# Altium project zytek_ctl.PrjPcb
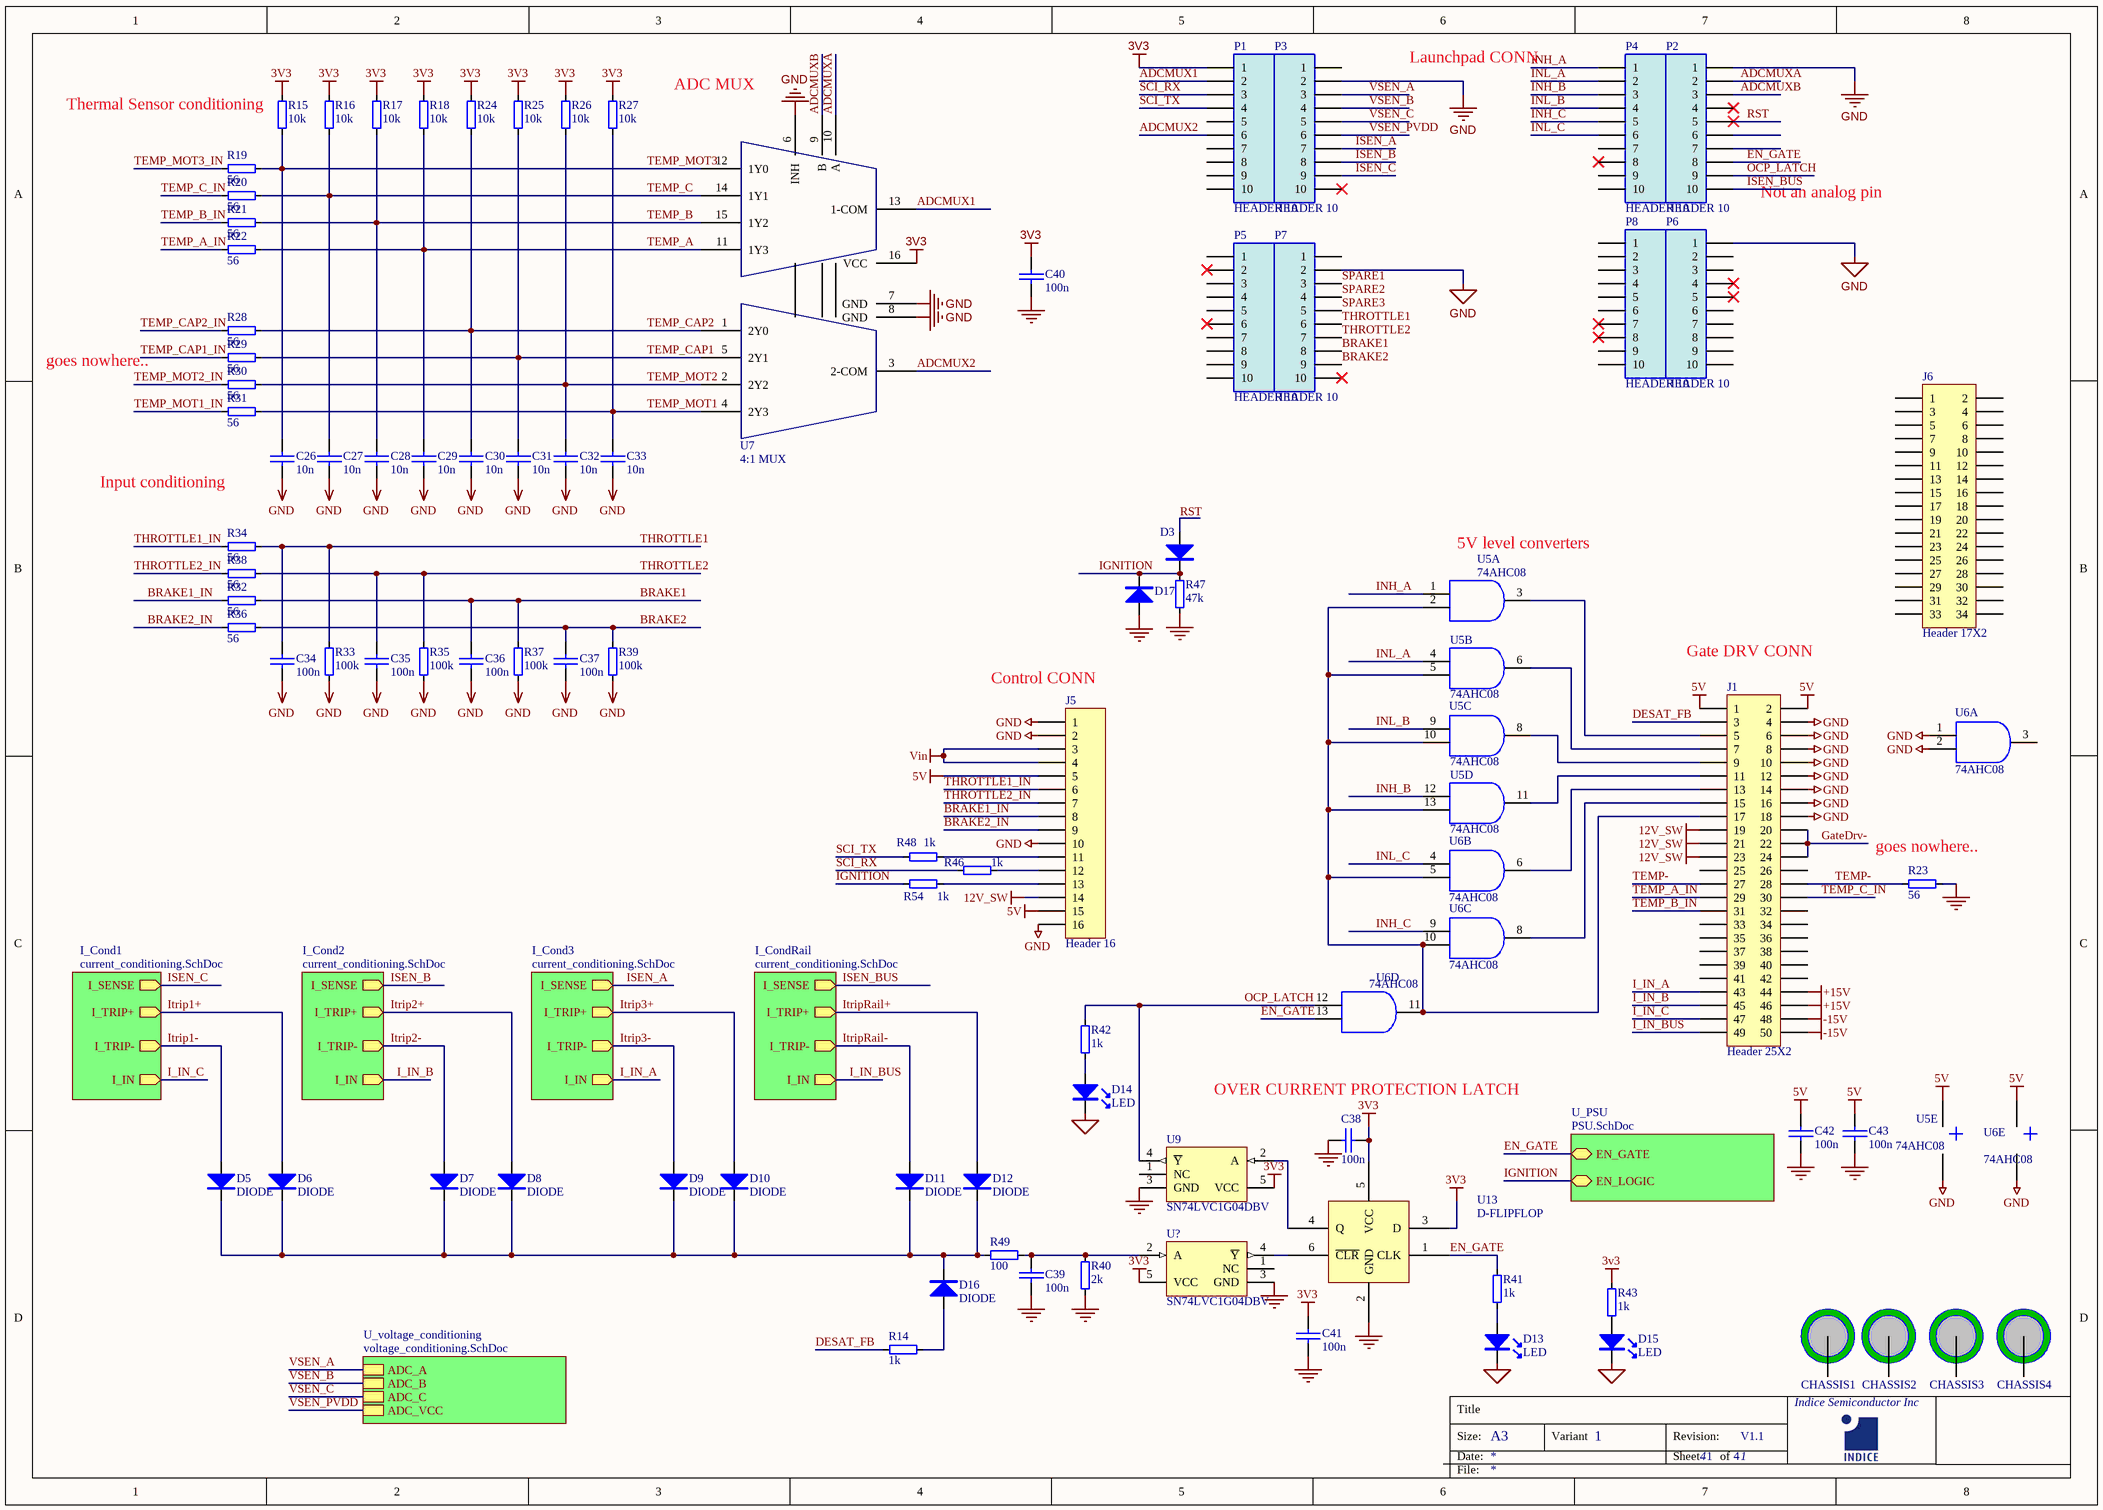
[diagram p0: zytek_ctl.SchDoc]
pcb_rev: V1.0; prjAuthor: Jarrod Tuma; PROJECT_NAME: 3-ph PLC control; sch_rev: V1.1
4 sheets, 278 parts. Net scope: hierarchical (ports join the sheet entries above them; power ports are global).
Board file: zytek_ctl.PcbDoc
Sheets:
  zytek_ctl.SchDoc
    U_PSU = PSU.SchDoc
    I_Cond1 = current_conditioning.SchDoc
    I_Cond2 = current_conditioning.SchDoc
    I_Cond3 = current_conditioning.SchDoc
    I_CondRail = current_conditioning.SchDoc
    U_voltage_conditioning = voltage_conditioning.SchDoc

## Sheet zytek_ctl.SchDoc
size A3; DocumentNumber: 1; SheetNumber: 1; SheetTotal: 4

### Parts
C26  10n  [0603]
C27  10n  [0603]
C28  10n  [0603]
C29  10n  [0603]
C30  10n  [0603]
C31  10n  [0603]
C32  10n  [0603]
C33  10n  [0603]
C34  100n  [0603]
C35  100n  [0603]
C36  100n  [0603]
C37  100n  [0603]
C38  100n  [0603]
C39  100n  [0603]
C40  100n  [0603]
C41  100n  [0603]
C42  100n  [0603]
C43  100n  [0603]
CHASSIS1  M2.0  [M4.0]  (value not drawn)  (no BOM)
CHASSIS2  M2.0  [M4.0]  (value not drawn)  (no BOM)
CHASSIS3  M2.0  [M4.0]  (value not drawn)  (no BOM)
CHASSIS4  M2.0  [M4.0]  (value not drawn)  (no BOM)
D3  (no value)  [SOD323-AK]
D5  DIODE  [D-0603]
D6  DIODE  [D-0603]
D7  DIODE  [D-0603]
D8  DIODE  [D-0603]
D9  DIODE  [D-0603]
D10  DIODE  [D-0603]
D11  DIODE  [D-0603]
D12  DIODE  [D-0603]
D13  LED  [0603_LED]
D14  LED  [0603_LED]
D15  LED  [0603_LED]
D16  DIODE  [D-0603]
D17  (no value)  [SOD323-AK]
J1  Header 25X2  [HDR2X20_2mm]
J5  Header 16  [HDR1X16]
J6  Header 17X2  [HDR2X17_2mm]
P1  HEADER 10  [HDR10]
P2  HEADER 10  [HDR10]
P3  HEADER 10  [HDR10]
P4  HEADER 10  [HDR10]
P5  HEADER 10  [HDR10]
P6  HEADER 10  [HDR10]
P7  HEADER 10  [HDR10]
P8  HEADER 10  [HDR10]
R14  1k  [0603]
R15  10k  [0603]
R16  10k  [0603]
R17  10k  [0603]
R18  10k  [0603]
R19  56  [0603]
R20  56  [0603]
R21  56  [0603]
R22  56  [0603]
R23  56  [0603]
R24  10k  [0603]
R25  10k  [0603]
R26  10k  [0603]
R27  10k  [0603]
R28  56  [0603]
R29  56  [0603]
R30  56  [0603]
R31  56  [0603]
R32  56  [0603]
R33  100k  [0603]
R34  56  [0603]
R35  100k  [0603]
R36  56  [0603]
R37  100k  [0603]
R38  56  [0603]
R39  100k  [0603]
R40  2k  [0603]
R41  1k  [0603]
R42  1k  [0603]
R43  1k  [0603]
R46  1k  [0603]
R47  47k  [0805]
R48  1k  [0603]
R49  100  [0603]
R54  1k  [0603]
U5  74AHC08  [SOIC14]  (parts A,B,C,D,E of 5)
U6  74AHC08  (parts A,B,C,D,E of 5)
U7  4:1 MUX  [SOIC16]
U9  SN74LVC1G04DBV  [SOT23-5]
U13  D-FLIPFLOP  [SOT23-6]
U?  SN74LVC1G04DBV  [SOT23-5]

### Sub-sheets
I_Cond1 = current_conditioning.SchDoc: I_SENSE (out), I_TRIP+ (out), I_TRIP- (out), I_IN (out)
I_Cond2 = current_conditioning.SchDoc: I_SENSE (out), I_TRIP+ (out), I_TRIP- (out), I_IN (out)
I_Cond3 = current_conditioning.SchDoc: I_SENSE (out), I_TRIP+ (out), I_TRIP- (out), I_IN (out)
I_CondRail = current_conditioning.SchDoc: I_SENSE (out), I_TRIP+ (out), I_TRIP- (out), I_IN (out)
U_PSU = PSU.SchDoc: EN_GATE, EN_LOGIC
U_voltage_conditioning = voltage_conditioning.SchDoc: ADC_A, ADC_B, ADC_C, ADC_VCC

### Nets
3v3: C38.1 C40.1 C41.1 P1.1 R15.2 R16.2 R17.2 R18.2 R24.2 R25.2 R26.2 R27.2 R43.2 U7.16(VCC) U9.5(VCC) U13.3(D) U13.5(VCC) U?.5(VCC)
5V: C42.1 C43.1 J1.1 J1.2 J5.5 J5.15 U5.14(Vcc) U6.14(Vcc)
12V_SW: J1.19 J1.21 J1.23 J5.14
+15V: J1.44 J1.46
-15V: J1.48 J1.50
GND: C26.2 C27.2 C28.2 C29.2 C30.2 C31.2 C32.2 C33.2 C34.2 C35.2 C36.2 C37.2 C38.2 C39.2 C40.2 C41.2 C42.2 C43.2 D13.2(K) D14.2(K) D15.2(K) D17.A J1.4 J1.6 J1.8 J1.10 J1.12 J1.14 J1.16 J1.18 J5.1 J5.2 J5.10 J5.16 P2.1 P3.2 P6.1 P7.2 R23.2 R33.1 R35.1 R37.1 R39.1 R40.2 R47.2 U5.7(GND) U6.1(1A) U6.2(1B) U6.7(GND) U7.6(INH) U7.7(GND) U7.8(GND) U9.3(GND) U13.2(GND) U?.3(GND)
Vin: J5.3 J5.4
ADCMUX1: P1.2 U7.13(1-COM)
ADCMUX2: P1.6 U7.3(2-COM)
ADCMUXA: P2.2 U7.10(A)
ADCMUXB: P2.3 U7.9(B)
BRAKE1: C36.1 P7.8 R32.2 R37.2
BRAKE1_IN: J5.8 R32.1
BRAKE2: C37.1 P7.9 R36.2 R39.2
BRAKE2_IN: J5.9 R36.1
DESAT_FB: J1.3 R14.2
EN_GATE: P2.8 R41.2 U6.13(4B) U13.1(CLK) ; sheet U_PSU/EN_GATE
GateDrv-: J1.20 J1.22 J1.24
I_IN_A: J1.43 ; sheet I_Cond3/I_IN
I_IN_B: J1.45 ; sheet I_Cond2/I_IN
I_IN_BUS: J1.49 ; sheet I_CondRail/I_IN
I_IN_C: J1.47 ; sheet I_Cond1/I_IN
IGNITION: D3.K D17.K R47.1 R54.1 ; sheet U_PSU/EN_LOGIC
INH_A: P4.1 U5.1(1A)
INH_B: P4.3 U5.12(4A)
INH_C: P4.5 U6.9(3A)
INL_A: P4.2 U5.4(2A)
INL_B: P4.4 U5.9(3A)
INL_C: P4.6 U6.4(2A)
ISEN_A: P3.7 ; sheet I_Cond3/I_SENSE
ISEN_B: P3.8 ; sheet I_Cond2/I_SENSE
ISEN_BUS: P2.10 ; sheet I_CondRail/I_SENSE
ISEN_C: P3.9 ; sheet I_Cond1/I_SENSE
Itrip1+: D6.A ; sheet I_Cond1/I_TRIP+
Itrip1-: D5.A ; sheet I_Cond1/I_TRIP-
Itrip2+: D8.A ; sheet I_Cond2/I_TRIP+
Itrip2-: D7.A ; sheet I_Cond2/I_TRIP-
Itrip3+: D10.A ; sheet I_Cond3/I_TRIP+
Itrip3-: D9.A ; sheet I_Cond3/I_TRIP-
ItripRail+: D12.A ; sheet I_CondRail/I_TRIP+
ItripRail-: D11.A ; sheet I_CondRail/I_TRIP-
OCP_LATCH: P2.9 R42.2 U6.12(4A) U9.4(~{Y})
RST: D3.A P2.5
SCI_RX: P1.3 R46.1
SCI_TX: P1.4 R48.1
SPARE1: P7.3
SPARE2: P7.4
SPARE3: P7.5
TEMP-: J1.27 J1.28 R23.1
TEMP_A: C29.1 R18.1 R22.2 U7.11(1Y3)
TEMP_A_IN: J1.29 R22.1
TEMP_B: C28.1 R17.1 R21.2 U7.15(1Y2)
TEMP_B_IN: J1.31 R21.1
TEMP_C: C27.1 R16.1 R20.2 U7.14(1Y1)
TEMP_C_IN: J1.30 R20.1
TEMP_CAP1: C31.1 R25.1 R29.2 U7.5(2Y1)
TEMP_CAP1_IN: R29.1
TEMP_CAP2: C30.1 R24.1 R28.2 U7.1(2Y0)
TEMP_CAP2_IN: R28.1
TEMP_MOT1: C33.1 R27.1 R31.2 U7.4(2Y3)
TEMP_MOT1_IN: R31.1
TEMP_MOT2: C32.1 R26.1 R30.2 U7.2(2Y2)
TEMP_MOT2_IN: R30.1
TEMP_MOT3: C26.1 R15.1 R19.2 U7.12(1Y0)
TEMP_MOT3_IN: R19.1
THROTTLE1: C34.1 P7.6 R33.2 R34.2
THROTTLE1_IN: J5.6 R34.1
THROTTLE2: C35.1 P7.7 R35.2 R38.2
THROTTLE2_IN: J5.7 R38.1
VSEN_A: P3.3 ; sheet U_voltage_conditioning/ADC_A
VSEN_B: P3.4 ; sheet U_voltage_conditioning/ADC_B
VSEN_C: P3.5 ; sheet U_voltage_conditioning/ADC_C
VSEN_PVDD: P3.6 ; sheet U_voltage_conditioning/ADC_VCC
NetC39_1: C39.1 R40.1 R49.2 U?.2(A)
NetD5_K: D5.K D6.K D7.K D8.K D9.K D10.K D11.K D12.K D16.K R49.1
NetD13_1: D13.1(A) R41.1
NetD14_1: D14.1(A) R42.1
NetD15_1: D15.1(A) R43.1
NetD16_A: D16.A R14.1
NetJ1_5: J1.5 U5.3(1Y)
NetJ1_7: J1.7 U5.6(2Y)
NetJ1_9: J1.9 U5.8(3Y)
NetJ1_11: J1.11 U5.11(4Y)
NetJ1_13: J1.13 U6.6(2Y)
NetJ1_15: J1.15 U6.8(3Y)
NetJ1_17: J1.17 U5.2(1B) U5.5(2B) U5.10(3B) U5.13(4B) U6.5(2B) U6.10(3B) U6.11(4Y)
NetJ5_11: J5.11 R48.2
NetJ5_12: J5.12 R46.2
NetJ5_13: J5.13 R54.2
NetU9_2: U9.2(A) U13.4(Q)
NetU13_6: U13.6(~{CLR}) U?.4(~{Y})

Not connected (* = marked no-connect by the designer): CHASSIS1 1; CHASSIS2 1; CHASSIS3 1; CHASSIS4 1; J1 25 26 32 33 34 35 36 37 38 39 40 41 42; J6 1 2 3 4 5 6 7 8 9 10 11 12 13 14 15 16 17 18 19 20 21 22 23 24 25 26 27 28 29 30 31 32 33 34; P1 5 7 8 9 10; P2 4* 6 7; P3 1 10*; P4 7 8* 9 10; P5 1 2* 3 4 5 6* 7 8 9 10; P6 2 3 4* 5* 6 7 8 9 10; P7 1 10*; P8 1 2 3 4 5 6 7* 8* 9 10; U6 3(1Y); U9 1(NC); U? 1(NC)

### Notes on the sheet
- (near R15) Thermal Sensor conditioning
- ADC MUX
- Launchpad CONN
- Not an analog pin
- goes nowhere..
- (near C26) Input conditioning
- (near U5) 5V level converters
- (near J5) Control CONN
- (near J1) Gate DRV CONN
- (near R23) goes nowhere..
- OVER CURRENT PROTECTION LATCH
- Title
- Size:
- Date:
- A3
- Variant
- Revision:
- Sheet
- of
- Indice Semiconductor Inc
- File:

### Library data of the parts
C26-C43 = CAP: Capacitor; Status: Draft
CHASSIS1-CHASSIS4 = M2.0_HOLE: 2.0mm Hole
D3 D17 = DIODE: Parameter: Signal, >=200mA, SOD323, Vr>=75V; Status: Draft
D13-D15 = LED: pin to pad: 1>A 2>K
J1 = Header 25X2: Header, 25-Pin, Dual row; LatestRevisionDate: 17-Jul-2002; LatestRevisionNote: Re-released for DXP Platform.; Publisher: Altium Limited
J5 = Header 16: Header, 16-Pin; LatestRevisionDate: 17-Jul-2002; LatestRevisionNote: Re-released for DXP Platform.; Publisher: Altium Limited
J6 = Header 17X2: Header, 17-Pin, Dual row; LatestRevisionDate: 17-Jul-2002; LatestRevisionNote: Re-released for DXP Platform.; Publisher: Altium Limited
P1-P8 = HEADER 10: 12 Pin Header; Status: Draft
R14 R19-R22 R28-R40 R49 = RES4: Parameter: 1%, Thick or Metal Film, 63mW
R15-R18 R24-R27 = RES4: Resistor; Parameter: *; Status: Draft
R23 R41-R43 R46 R48 R54 = RESISTOR: Parameter: *; Status: Draft
R47 = RESISTOR: Parameter: <1%, Thick film, 63mW; Status: Draft
U5 U6 = 74AHC08_QUAD_AND: Quad AND Gate
U7 = SN74LV4052A
U9 U? = CMP-0441-00001-1: Single Inverter Gate SOT-553; Manufacturer: Texas Instruments; Supply Voltage: 1.65 to 5.5 V; ComponentLink3URL: http://www.ti.com/litv/pdf/mpds018i; DatasheetVersion: SCES214Z, 11/2012; ComponentLink2URL: http://www.ti.com/lit/ds/symlink/sn74lvc1g04.pdf; Mounting Technology: Surface Mount; PackageDescription: 5-Pin Plastic Small Outline, Body 1.6 Ã— 2.9 mm, Pitch 0.95 mm; PackageVersion: 4073253-4/K, 03/2006; PackageReference: DBV5; Storage Temperature: -65 to 150 degC; ComponentLink3Description: Package Specification; ComponentLink2Description: Datasheet; Ambient Temperature: -40 to 85 degC; PartNumber: SN74LVC1G04DBV; ComponentLink1Description: Manufacturer URL; ComponentLink1URL: http://www.ti.com/
U13 = D-FLIPFLOP: With reset; Manufacturer 1: TI SN74LVC1G175; Digikey: 296-17617-1-ND
D5-D12 D16 = DIODE: Status: Draft

## Sheet PSU.SchDoc
size A; DocumentNumber: 3; SheetNumber: 3; SheetTotal: 4; PageSetup: Record=PageOptions|CenterHorizontal=True|CenterVertical=True|PrintScale=1.00|XCorrection=1.00|YCorrection=1.00|PrintKind=1|BorderSize=5000000|LeftOffset=0|BottomOffset=0|Orientation=2|PaperLength=1000|PaperWidth=1000|Scale=100|PaperSource=7|PrintQuality=-3|MediaType=1|DitherType=10|PrintScaleMode=1|PaperKind=A4|PaperIndex=9
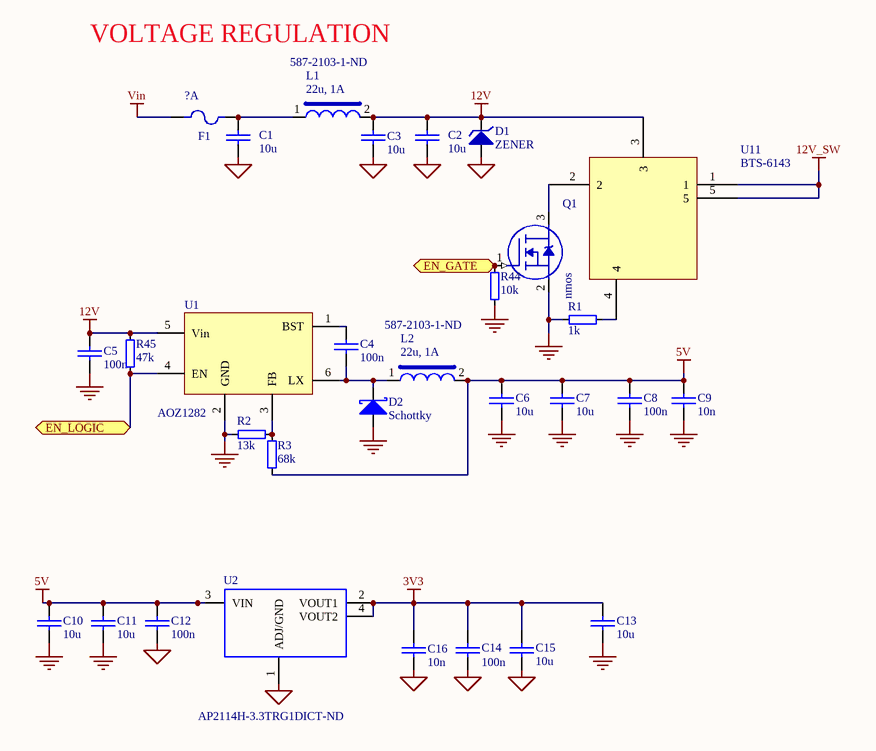
[diagram p1: PSU.SchDoc]

### Parts
C1  10u  [0805]
C2  10u  [0805]
C3  10u  [0805]
C4  100n  [0603]
C5  100n  [0603]
C6  10u  [0805]
C7  10u  [0805]
C8  100n  [0603]
C9  10n  [0603]
C10  10u  [0805]
C11  10u  [0805]
C12  100n  [0603]
C13  10u  [0805]
C14  100n  [0603]
C15  10u  [0805]
C16  10n  [0603]
D1  ZENER  [DO214AC]
D2  Schottky  [DO214AC]
F1  ?A  [1206]
L1  22u, 1A  Supplier Part Number 1: 587-2103-1-ND  [2220]
L2  22u, 1A  Supplier Part Number 1: 587-2103-1-ND  [2220]
Q1  nmos  [SOT23]
R1  1k  [0603]
R2  13k  [0603]
R3  68k  [0603]
R44  10k  [0603]
R45  47k  [0805]
U1  AOZ1282  [SOT23-6]
U2  AP2114H-3.3TRG1DICT-ND  [SOT223]
U11  BTS-6143  [TO252-5-11]

### Ports
EN_GATE, EN_LOGIC

### Nets
3v3: C13.2 C14.1 C15.1 C16.1 U2.2(VOUT1) U2.4(VOUT2)
5V: C6.2 C7.2 C8.1 C9.1 C10.2 C11.2 C12.1 L2.2 R3.1 U2.3(VIN)
12V: C2.1 C3.1 C5.1 D1.K L1.2 R45.1 U1.5(Vin) U11.3
12V_SW: U11.1 U11.5
GND: C1.2 C2.2 C3.2 C5.2 C6.1 C7.1 C8.2 C9.2 C10.1 C11.1 C12.2 C13.1 C14.2 C15.2 C16.2 D1.A D2.A Q1.2(S) R1.1 R2.1 R44.2 U1.2(GND) U2.1(ADJ/GND)
Vin: F1.1
EN_GATE: Q1.1(G) R44.1 ; port EN_GATE
IGNITION: R45.2 U1.4(EN) ; port EN_LOGIC
NetC1_1: C1.1 F1.2 L1.1
NetC4_1: C4.1 D2.K L2.1 U1.6(LX)
NetC4_2: C4.2 U1.1(BST)
NetQ1_3: Q1.3(D) U11.2
NetR1_2: R1.2 U11.4
NetR2_2: R2.2 R3.2 U1.3(FB)

### Notes on the sheet
- VOLTAGE REGULATION

### Library data of the parts
C1-C3 C12 C15 = CAP: Capacitor; Status: Draft
C4 C5 C8 C9 = CAP: Manufacturer 1: Murata GRM188R71H104KA93D; Parameter: 100n, 0603, 50V, <20%, X7R Ceramic; Digikey Part Number: PCC2153CT-ND; Manufacturer 2: TDK C1608X7R1H104K; Manufacturer 3: AVX 06035C104KAT2A; Manufacturer 5: Yageo CC0603KRX7R9BB104; Manufacturer 4: Kemet C0603C104J5RACTU-ND
C6 C7 C10 C11 C13 = CAP: Capacitor; Parameter: 10uF, 0805, =>6.3V, <=10%, X5R Ceramic
C14 = CAP: Manufacturer 1: Murata GCM188R71C474KA55D; Parameter: 470n, 0603, >=16V, <20%, X7R Ceramic; Digikey Part Number: 490-4775-1-ND; Manufacturer 2: Taiyo EMK107B7474KA-T; Manufacturer 3: Kemet C0603C474K4RACTU, C0603C474K4RAC; Manufacturer 4: TDK C1608X7R1C474M
C16 = CAP: Manufacturer 1: Murata GRM188R71H103KA01D; Parameter: 10n, 0603, 50V, <20%, X7R Ceramic; Digikey Part Number: PCC2153CT-ND; Manufacturer 2: AVX	06035C103KAT2A; Manufacturer 3: TDK  C1608X7R1H103J
D1 = ZENER: Zener Diode; Manufacturer 1: *; Manufacturer 2: *; Manufacturer 3: *; Parameter: *; Status: Draft
D2 = DIODE SCHOTTKY: Schottky Diode; Manufacturer 1: Micro Commercial Co SD103AWS-TP; Parameter: DIODE SHOTTKY >30V >0.2A; Digikey Part Number: SD103AWSTPMSCT-ND; Status: Draft
F1 = FUSE: Thermal Fuse
L1 L2 = INDUCTOR-1 COIL: Standard single coil inductor; Parameter: INDUCTOR 22uH >1A 1210; Manufacturer 2: *; Manufacturer 3: *; Status: Draft; Supplier 1: Digi-Key
Q1 = MOSFET-N: N-Channel MOSFET; Manufacturer 1: *; Manufacturer 2: *; Manufacturer 3: *; Parameter: *; Status: Draft
R1-R3 R45 = RESISTOR: Parameter: <1%, Thick film, 63mW; Status: Draft
R44 = RES4: Parameter: 1%, Thick or Metal Film, 63mW
U1 = AOZ1280: Manufacturer 1: Alpha & Omega AOZ1282CI; Parameter: 1.2A, 4.5V-36V input, 450KHz; Digikey Part Number: 785-1613-1-ND
U2 = TLV1117-33

## Sheet current_conditioning.SchDoc
size A4; DocumentNumber: 2; SheetNumber: 2; SheetTotal: 4
Used 4 times, as channels I_Cond1, I_Cond2, I_Cond3, I_CondRail. Parts and nets are listed once, with the designators drawn on the sheet.
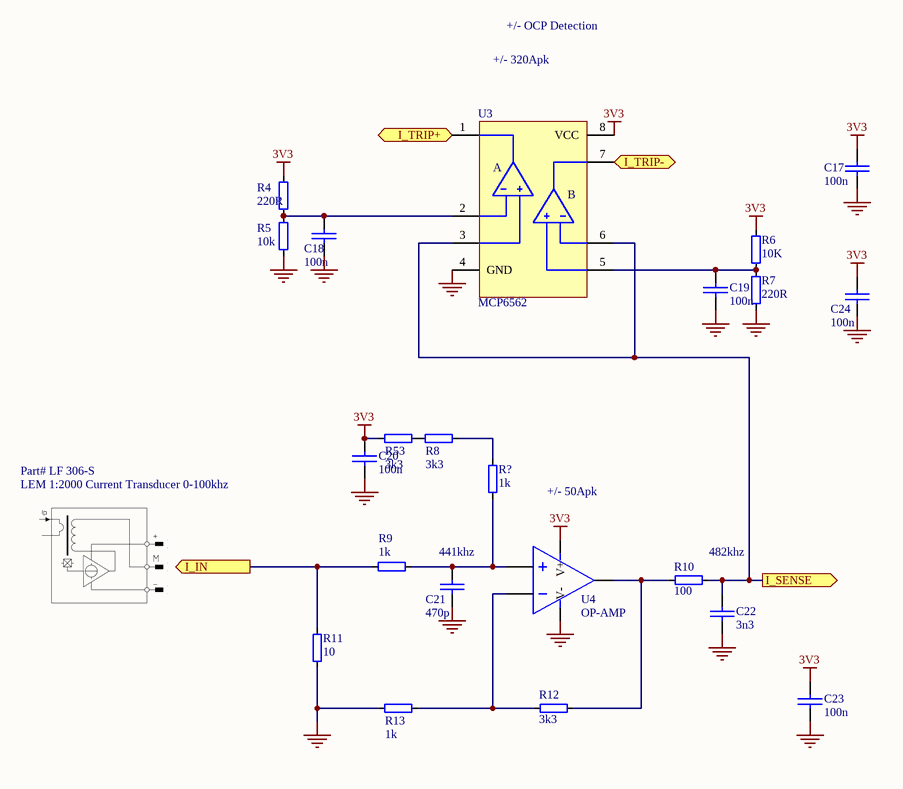
[diagram p2: current_conditioning.SchDoc]

### Parts
C17  100n  [0603]
C18  100n  [0603]
C19  100n  [0603]
C20  100n  [0603]
C21  470p  [0603]
C22  3n3  [0603]
C23  100n  [0603]
C24  100n  [0603]
R4  220R  [0603]
R5  10k  [0603]
R6  10K  [0603]
R7  220R  [0603]
R8  3k3  [0603]
R9  1k  [0603]
R10  100  [0603]
R11  10  [1206]
R12  3k3  [0603]
R13  1k  [0603]
R53  3k3  [0603]
R?  1k  [0603]
U3  MCP6562  [MSOP8]
U4  OP-AMP  [SOT23-5]

### Ports
I_IN (out), I_SENSE (out), I_TRIP+ (out), I_TRIP- (out)

### Nets
3V3: C17.1 C20.2 C23.1 C24.1 R4.2 R6.2 R53.1 U3.8(VCC) U4.5(V+)
GND: C17.2 C18.2 C19.2 C20.1 C21.2 C22.1 C23.2 C24.2 R5.1 R7.1 R11.1 R13.1 U3.4(GND) U4.2(V-)
I_IN: R9.1 R11.2 ; port I_IN
I_SENSE: C22.2 R10.2 U3.3(+A) U3.6(-B) ; port I_SENSE
I_TRIP+: U3.1(OUTA) ; port I_TRIP+
I_TRIP-: U3.7(OUTB) ; port I_TRIP-
NetC18_1: C18.1 R4.1 R5.2 U3.2(-A)
NetC19_1: C19.1 R6.1 R7.2 U3.5(+B)
NetC21_1: C21.1 R9.2 R?.1 U4.3(IN+)
NetR8_1: R8.1 R53.2
NetR8_2: R8.2 R?.2
NetR10_1: R10.1 R12.2 U4.1(OUT)
NetR12_1: R12.1 R13.2 U4.4(IN-)

### Channels
I_Cond1: designators end in _I_Cond1; ports I_IN=I_IN_C I_SENSE=ISEN_C I_TRIP+=Itrip1+ I_TRIP-=Itrip1-
I_Cond2: designators end in _I_Cond2; ports I_IN=I_IN_B I_SENSE=ISEN_B I_TRIP+=Itrip2+ I_TRIP-=Itrip2-
I_Cond3: designators end in _I_Cond3; ports I_IN=I_IN_A I_SENSE=ISEN_A I_TRIP+=Itrip3+ I_TRIP-=Itrip3-
I_CondRail: designators end in _I_CondRail; ports I_IN=I_IN_BUS I_SENSE=ISEN_BUS I_TRIP+=ItripRail+ I_TRIP-=ItripRail-

### Notes on the sheet
- +/- OCP Detection
- +/- 320Apk
- LEM 1:2000 Current Transducer 0-100khz
- Part# LF 306-S
- +/- 50Apk
- 441khz
- (near R10) 482khz
- (in symbol COMPARATOR DUAL draft) A; B

### Library data of the parts
C17 C20 C22 C23 = CAP
C18 C19 C21 C24 = CAP: Capacitor; Status: Draft
R4-R13 R53 R? = RES4: Parameter: 1%, Thick or Metal Film, 63mW
U3 = COMPARATOR DUAL draft: Manufacturer 1: Microchip MCP6562
U4 = OP-AMP: Operational Amplifier; Manufacturer 1: Microchip MCP6283T; Parameter: >1MHz, 3.3V, rail-rail.; Digikey Part Number: MCP6283T-E/CHCT-ND; Manufacturer 2: Fairchild FAN4174IS5X; Status: Draft

## Sheet voltage_conditioning.SchDoc
size A4
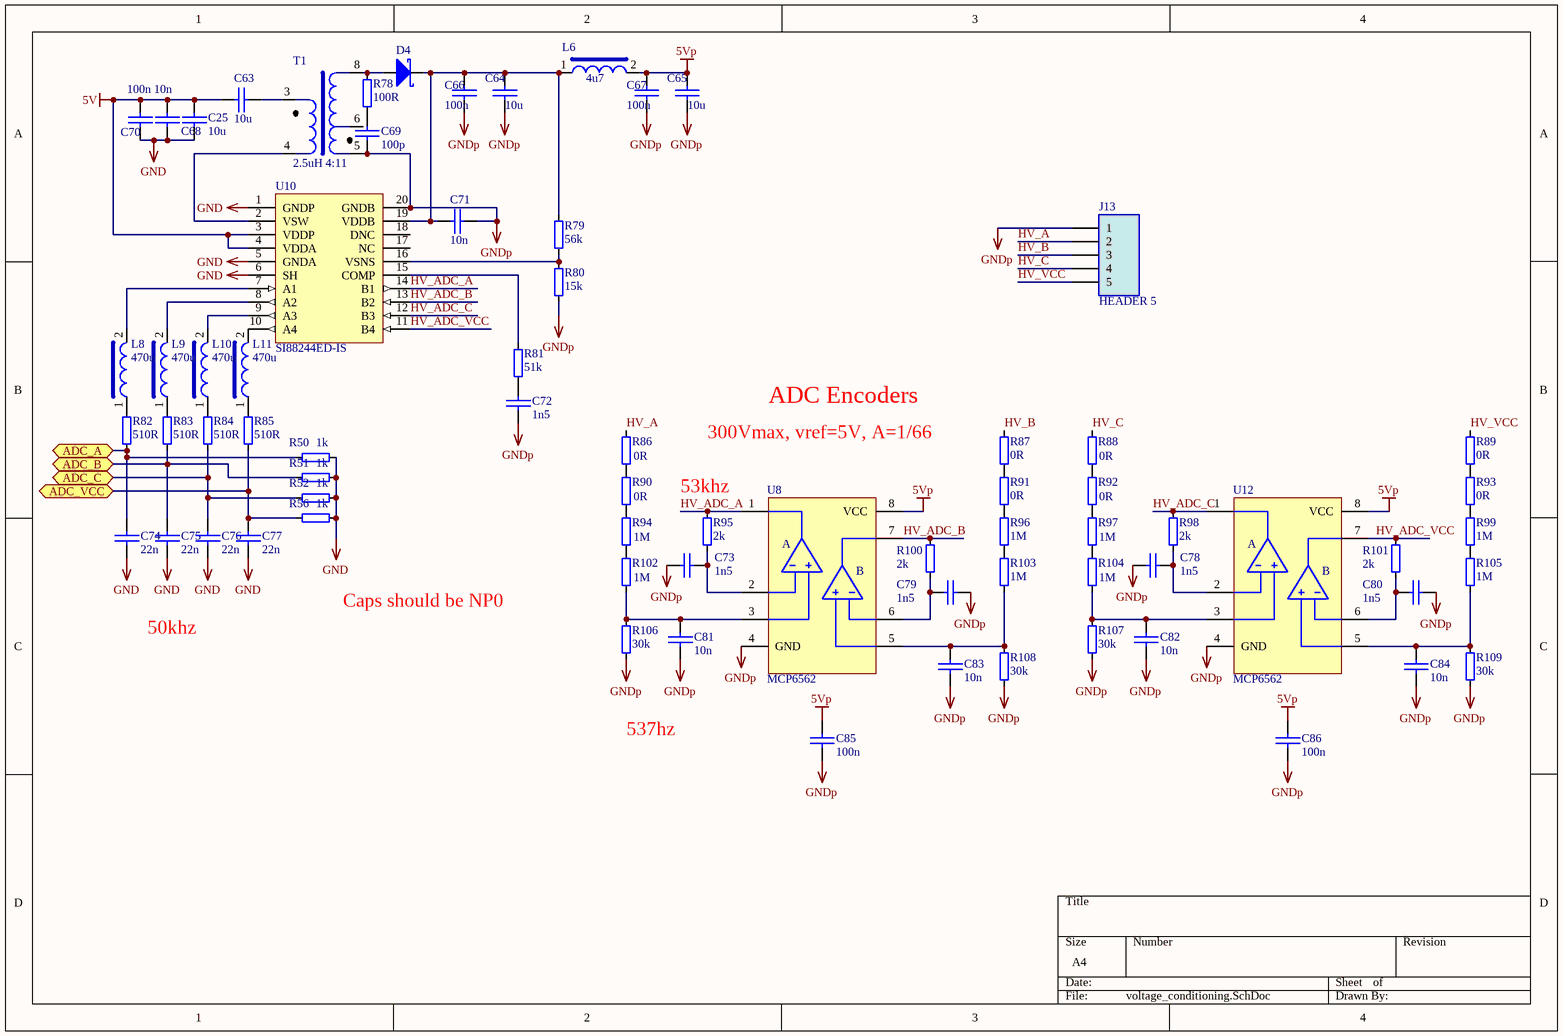
[diagram p3: voltage_conditioning.SchDoc]

### Parts
C25  10u  [0805]
C63  10u  [0805]
C64  10u  [0805]
C65  10u  [0805]
C66  100n  [0603]
C67  100n  [0603]
C68  10n  [0603]
C69  100p  [0603]
C70  100n  [0603]
C71  10n  [0603]
C72  1n5  [0603]
C73  1n5  [0603]
C74  22n  [0603]
C75  22n  [0603]
C76  22n  [0603]
C77  22n  [0603]
C78  1n5  [0603]
C79  1n5  [0603]
C80  1n5  [0603]
C81  10n  [0603]
C82  10n  [0603]
C83  10n  [0603]
C84  10n  [0603]
C85  100n  [0603]
C86  100n  [0603]
D4  DIODE SCHOTTKY  [SOD323-AK]  (value not drawn)
J13  HEADER 5  [HDR5-5mm]
L6  4u7  [0805]
L8  470u  [0805]
L9  470u  [0805]
L10  470u  [0805]
L11  470u  [0805]
R50  1k  [0603]
R51  1k  [0603]
R52  1k  [0603]
R56  1k  [0603]
R78  100R  [0603]
R79  56k  [0603]
R80  15k  [0603]
R81  51k  [0603]
R82  510R  [0603]
R83  510R  [0603]
R84  510R  [0603]
R85  510R  [0603]
R86  0R  [1206]
R87  0R  [1206]
R88  0R  [1206]
R89  0R  [1206]
R90  0R  [1206]
R91  0R  [1206]
R92  0R  [1206]
R93  0R  [1206]
R94  1M  [1206]
R95  2k  [0603]
R96  1M  [1206]
R97  1M  [1206]
R98  2k  [0603]
R99  1M  [1206]
R100  2k  [0603]
R101  2k  [0603]
R102  1M  [1206]
R103  1M  [1206]
R104  1M  [1206]
R105  1M  [1206]
R106  30k  [0603]
R107  30k  [0603]
R108  30k  [0603]
R109  30k  [0603]
T1  2.5uH 4:11  [RM5/I]
U8  MCP6562  [MSOP8]
U10  SI88244ED-IS  [SLAB-SOIC-20-WB_N]
U12  MCP6562  [MSOP8]

### Ports
ADC_A, ADC_B, ADC_C, ADC_VCC

### Nets
5V: C25.2 C63.1 C68.1 C70.1 U10.3(VDDP) U10.4(VDDA)
5Vp: C65.1 C67.1 C85.1 C86.1 L6.2 U8.8(VCC) U12.8(VCC)
GND: C25.1 C68.2 C70.2 C74.1 C75.1 C76.1 C77.1 R50.1 R51.1 R52.1 R56.1 U10.1(GNDP) U10.5(GNDA) U10.6(SH)
GNDp: C64.2 C65.2 C66.2 C67.2 C69.2 C71.2 C72.2 C73.1 C78.1 C79.1 C80.1 C81.1 C82.1 C83.2 C84.2 C85.2 C86.2 J13.1 R80.2 R106.1 R107.1 R108.2 R109.2 T1.5 U8.4(GND) U10.20(GNDB) U12.4(GND)
HV_A: J13.2 R86.2
HV_ADC_A: R95.2 U8.1(OUTA) U10.14(B1)
HV_ADC_B: R100.2 U8.7(OUTB) U10.13(B2)
HV_ADC_C: R98.2 U10.12(B3) U12.1(OUTA)
HV_ADC_VCC: R101.2 U10.11(B4) U12.7(OUTB)
HV_B: J13.3 R87.2
HV_C: J13.4 R88.2
HV_VCC: J13.5 R89.2
VSEN_A: C74.2 R50.2 R82.1 ; port ADC_A
VSEN_B: C75.2 R51.2 R83.1 ; port ADC_B
VSEN_C: C76.2 R52.2 R84.1 ; port ADC_C
VSEN_PVDD: C77.2 R56.2 R85.1 ; port ADC_VCC
NetC63_2: C63.2 T1.3
NetC64_1: C64.1 C66.1 C71.1 D4.K L6.1 R79.2 U10.19(VDDB)
NetC69_1: C69.1 R78.1
NetC72_1: C72.1 R81.1
NetC73_2: C73.2 R95.1 U8.2(-A)
NetC78_2: C78.2 R98.1 U12.2(-A)
NetC79_2: C79.2 R100.1 U8.6(-B)
NetC80_2: C80.2 R101.1 U12.6(-B)
NetC81_2: C81.2 R102.1 R106.2 U8.3(+A)
NetC82_2: C82.2 R104.1 R107.2 U12.3(+A)
NetC83_1: C83.1 R103.1 R108.1 U8.5(+B)
NetC84_1: C84.1 R105.1 R109.1 U12.5(+B)
NetD4_A: D4.A R78.2 T1.8
NetL8_1: L8.1 R82.2
NetL8_2: L8.2 U10.7(A1)
NetL9_1: L9.1 R83.2
NetL9_2: L9.2 U10.8(A2)
NetL10_1: L10.1 R84.2
NetL10_2: L10.2 U10.9(A3)
NetL11_1: L11.1 R85.2
NetL11_2: L11.2 U10.10(A4)
NetR79_1: R79.1 R80.1 U10.16(VSNS)
NetR81_2: R81.2 U10.15(COMP)
NetR86_1: R86.1 R90.2
NetR87_1: R87.1 R91.2
NetR88_1: R88.1 R92.2
NetR89_1: R89.1 R93.2
NetR90_1: R90.1 R94.2
NetR91_1: R91.1 R96.2
NetR92_1: R92.1 R97.2
NetR93_1: R93.1 R99.2
NetR94_1: R94.1 R102.2
NetR96_1: R96.1 R103.2
NetR97_1: R97.1 R104.2
NetR99_1: R99.1 R105.2
NetT1_4: T1.4 U10.2(VSW)

Not connected (* = marked no-connect by the designer): T1 6; U10 17(NC) 18(DNC)

### Notes on the sheet
- 300Vmax, vref=5V, A=1/66
- ADC Encoders
- (near R95) 53khz
- 50khz
- Caps should be NP0
- 537hz
- (in symbol COMPARATOR DUAL draft) A; B

### Library data of the parts
C25 C63-C68 C70 C71 C74-C77 C79-C84 = CAP: Capacitor
  C25 C63-C68 C70 C71 C74-C77: Status: Draft
  C79-C84: Supplier 1: Digi-Key
C69 C72 = CAP: as C16 on sheet PSU; Digikey Part Number: PCC2153CT-ND; Manufacturer 2: AVX	06035C103KAT2A; Manufacturer 3: TDK  C1608X7R1H103J
C73 C78 = CAP: COG/NPO; Supplier 1: Digi-Key
C85 C86 = CAP: Supplier 1: Digi-Key
D4 = DIODE SCHOTTKY: Schottky Diode; Status: Draft
J13 = HEADER 5: 4 Pin Header; Status: Draft
L6 = INDUCTOR-1 COIL: Standard single coil inductor; Manufacturer 1: Taiyo Yuden  LBR2012T4R7M; Parameter: Inductor, 4u7, 20%, >100mA; Manufacturer 2: Abracon 	AIML-0805-4R7K-T; Manufacturer 3: Bourns 	CV201210-4R7K; Status: Draft; Digikey Part Number: 587-2907-1-ND; Manufacturer 4: TDK MLZ2012N4R7L
L8-L11 = INDUCTOR-1 COIL: Standard single coil inductor; Parameter: 470uH 80mA; Supplier 1: Digi-Key; Supplier Part Number 1: 587-3061-1-ND
R50-R52 R56 R80 R82-R85 R106 R107 = RESISTOR: Parameter: *
  R50-R52 R56 R82-R85 R106 R107: Supplier 1: Digi-Key
  R80: Status: Draft
R78 R79 R81 R95 R98 R100 R101 R108 R109 = RES4: Resistor; Parameter: *
  R78 R79 R81: Status: Draft
  R95 R98 R100 R101 R108 R109: Supplier 1: Digi-Key
R86-R94 R96 R97 R99 R102-R105 = RES4: Resistor; Parameter: High Voltage; Supplier Part Number 1: RHM1MAICT-ND; Supplier 1: Digi-Key
T1 = TRANSFORMER-2 COIL 1L 1R_1t: 2Coil Transformer 1 on left 1 on right with tap; Phasing: *; Parameter: *; Manufacturer 1: *; Manufacturer 2: *; Manufacturer 3: *; Status: Draft
U8 U12 = COMPARATOR DUAL draft: Supplier Part Number 1: MCP6562T-E/MSCT-ND; Supplier 1: Digi-Key
U10 = SI88243ED-IS: Low-Power Quad-Channel Digital Isolator, 100 Mbps, 1 kVRMS Isolation Rating, -40 to 125 degC, 16-pin SOIC; Manufacturer: Silicon Labs; Supplier 1: Digi-Key; Supplier Part Number 1: 336-3242-ND; PartNumber: SI88243ED-IS

## Nets that join several sheets
3v3: zytek_ctl (18 pins), PSU (6 pins), I_Cond1 (9 pins), I_Cond2 (9 pins), I_Cond3 (9 pins), I_CondRail (9 pins)
5V: zytek_ctl (8 pins), PSU (10 pins), voltage_conditioning (6 pins)
12V_SW: zytek_ctl (J1.19 J1.21 J1.23 J5.14), PSU (U11.1 U11.5)
GND: zytek_ctl (55 pins), PSU (23 pins), I_Cond1 (14 pins), I_Cond2 (14 pins), I_Cond3 (14 pins), I_CondRail (14 pins), voltage_conditioning (14 pins)
Vin: zytek_ctl (J5.3 J5.4), PSU (F1.1)
EN_GATE: zytek_ctl (P2.8 R41.2 U6.13 U13.1), PSU (Q1.1 R44.1)
I_IN_A: zytek_ctl (J1.43), I_Cond3 (R9_I_Cond3.1 R11_I_Cond3.2)
I_IN_B: zytek_ctl (J1.45), I_Cond2 (R9_I_Cond2.1 R11_I_Cond2.2)
I_IN_BUS: zytek_ctl (J1.49), I_CondRail (R9_I_CondRail.1 R11_I_CondRail.2)
I_IN_C: zytek_ctl (J1.47), I_Cond1 (R9_I_Cond1.1 R11_I_Cond1.2)
IGNITION: zytek_ctl (D3.K D17.K R47.1 R54.1), PSU (R45.2 U1.4)
ISEN_A: zytek_ctl (P3.7), I_Cond3 (C22_I_Cond3.2 R10_I_Cond3.2 U3_I_Cond3.3 U3_I_Cond3.6)
ISEN_B: zytek_ctl (P3.8), I_Cond2 (C22_I_Cond2.2 R10_I_Cond2.2 U3_I_Cond2.3 U3_I_Cond2.6)
ISEN_BUS: zytek_ctl (P2.10), I_CondRail (C22_I_CondRail.2 R10_I_CondRail.2 U3_I_CondRail.3 U3_I_CondRail.6)
ISEN_C: zytek_ctl (P3.9), I_Cond1 (C22_I_Cond1.2 R10_I_Cond1.2 U3_I_Cond1.3 U3_I_Cond1.6)
Itrip1+: zytek_ctl (D6.A), I_Cond1 (U3_I_Cond1.1)
Itrip1-: zytek_ctl (D5.A), I_Cond1 (U3_I_Cond1.7)
Itrip2+: zytek_ctl (D8.A), I_Cond2 (U3_I_Cond2.1)
Itrip2-: zytek_ctl (D7.A), I_Cond2 (U3_I_Cond2.7)
Itrip3+: zytek_ctl (D10.A), I_Cond3 (U3_I_Cond3.1)
Itrip3-: zytek_ctl (D9.A), I_Cond3 (U3_I_Cond3.7)
ItripRail+: zytek_ctl (D12.A), I_CondRail (U3_I_CondRail.1)
ItripRail-: zytek_ctl (D11.A), I_CondRail (U3_I_CondRail.7)
VSEN_A: zytek_ctl (P3.3), voltage_conditioning (C74.2 R50.2 R82.1)
VSEN_B: zytek_ctl (P3.4), voltage_conditioning (C75.2 R51.2 R83.1)
VSEN_C: zytek_ctl (P3.5), voltage_conditioning (C76.2 R52.2 R84.1)
VSEN_PVDD: zytek_ctl (P3.6), voltage_conditioning (C77.2 R56.2 R85.1)

## Assembly variants
Default: not fitted C57 C75 C77 C78 D4 D13 R5 R6 R19